# EAGLE design board (EAGLE 9.6.2)
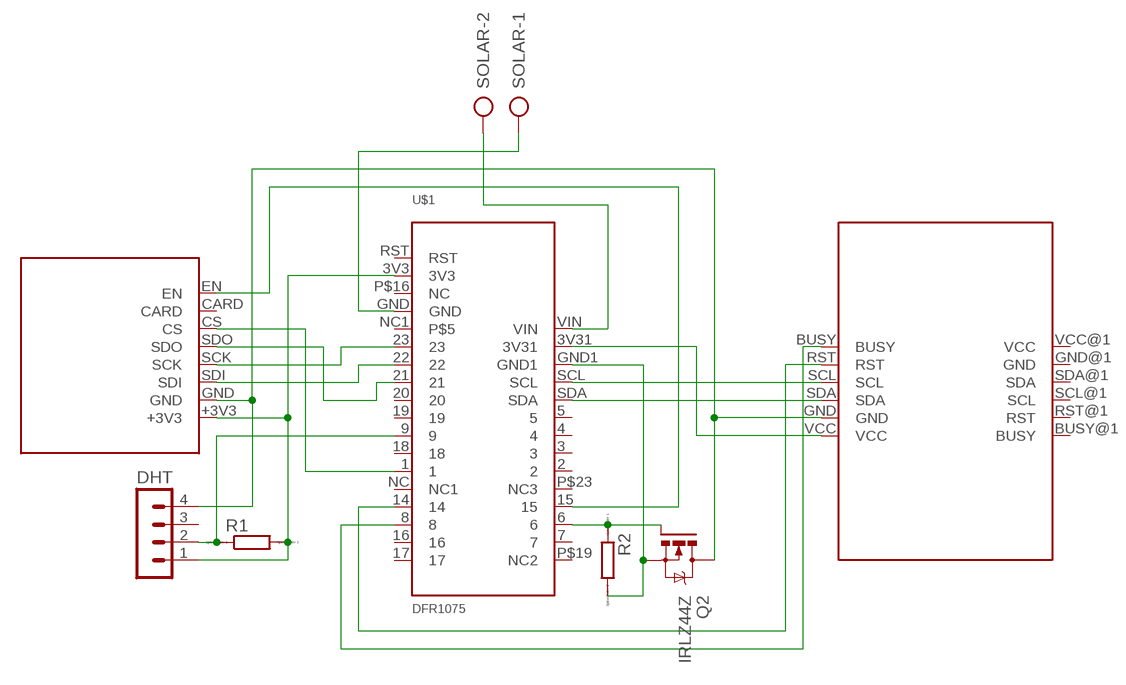
[diagram p0: schematic, sheet 1]

## Parts
DHT  MA04-1  [MA04-1]
Q2  IRLZ44Z  [TO220BH]
R1  R0207/10  [0207/10]
R2  R0207/10  [0207/10]
SOLAR  AK300/2  [AK300/2]
U$1  DFR1075  [DFR1075]
U$2  1.9INCH_WAVESHARE_E-PAPER  [1.9INCH_WAVESHARE_E-PAPER]
U$3  LASKAKIT-MICROSD-READER  [LASKAKIT-MICROSD-READER]

## Nets
BUSY: U$1.8 U$2.BUSY
GND: DHT.4 Q2.D U$2.GND U$3.GND
N$1: Q2.G R2.1 U$1.6
N$2: Q2.S R2.2 U$1.GND1
N$3: U$1.SCL U$2.SCL
N$4: U$1.SDA U$2.SDA
N$5: U$1.3V31 U$2.VCC
N$6: SOLAR.2 U$1.VIN
N$9: DHT.1 R1.2 U$1.3V3 U$3.+3V3
N$10: DHT.2 R1.1 U$1.9
N$11: U$1.22 U$3.SDI
N$12: U$1.23 U$3.SCK
N$13: U$1.21 U$3.SDO
N$14: U$1.1 U$3.CS
N$15: SOLAR.1 U$1.GND
N$16: U$1.15 U$3.EN
RST: U$1.14 U$2.RST
Unconnected: DHT.3 U$1.2 U$1.3 U$1.4 U$1.5 U$1.7 U$1.16 U$1.17 U$1.18 U$1.19 U$1.20 U$1.NC1 U$1.NC(NC1) U$1.P$16(NC) U$1.P$19(NC2) U$1.P$23(NC3) U$1.RST U$2.BUSY@1(BUSY) U$2.GND@1(GND) U$2.RST@1(RST) U$2.SCL@1(SCL) U$2.SDA@1(SDA) U$2.VCC@1(VCC) U$3.CARD

## Library data of the parts
DHT = con-lstb:MA04-1: PIN HEADER; OC_FARNELL: unknown; OC_NEWARK: unknown
Q2 = transistor-power:IRLZ44Z: N-Channel HEXFET® Power MOSFET Logic Level AUTOMOTIVE MOSFET Source: http://www.irf.com/product-info/datasheets/data/irlz44zpbf.pdf
R1 R2 = eagle-ltspice:R: RESISTOR, European symbol; SPICEMODEL: NONE; SPICEPREFIX: R
SOLAR = con-ptr500:AK300/2: CONNECTOR; OC_FARNELL: unknown; OC_NEWARK: unknown
U$1 = Diplomova_prace:DFR1075
U$2 = Diplomova_prace:1.9INCH_WAVESHARE_E-PAPER
U$3 = Diplomova_prace:LASKAKIT-MICROSD-READER

## Board
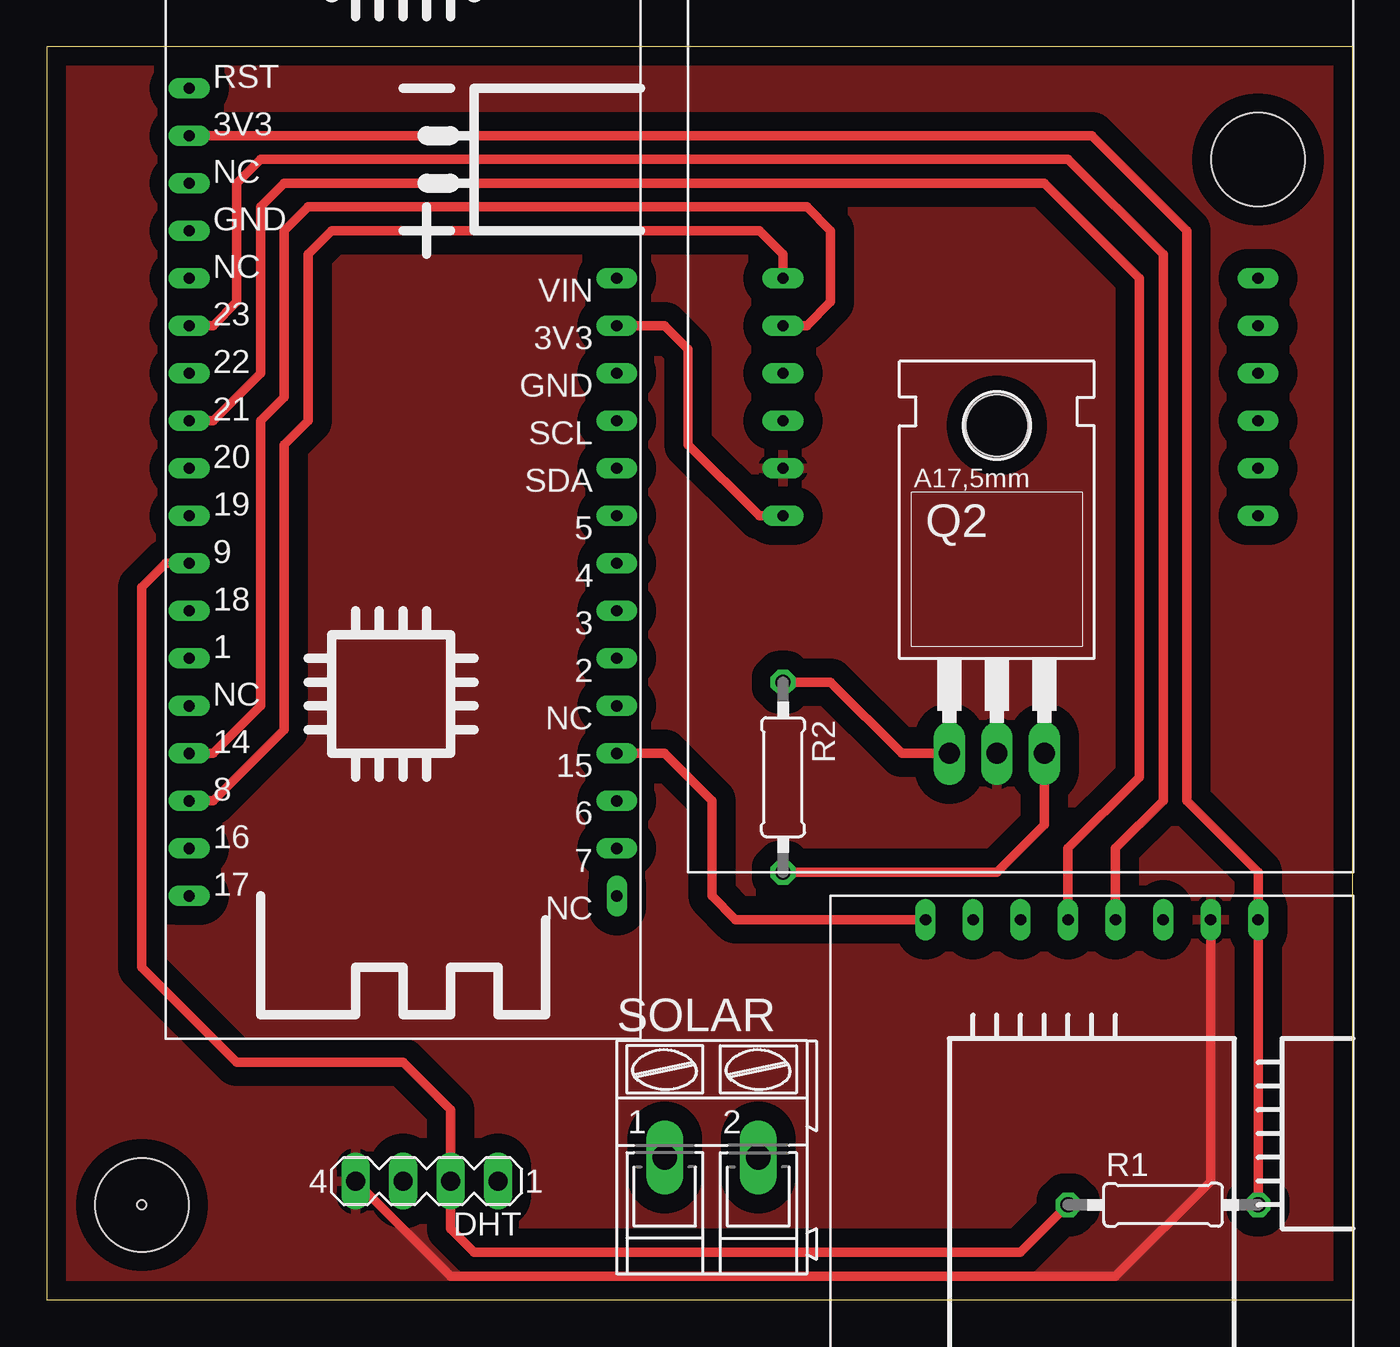
[diagram p1: board, top side]
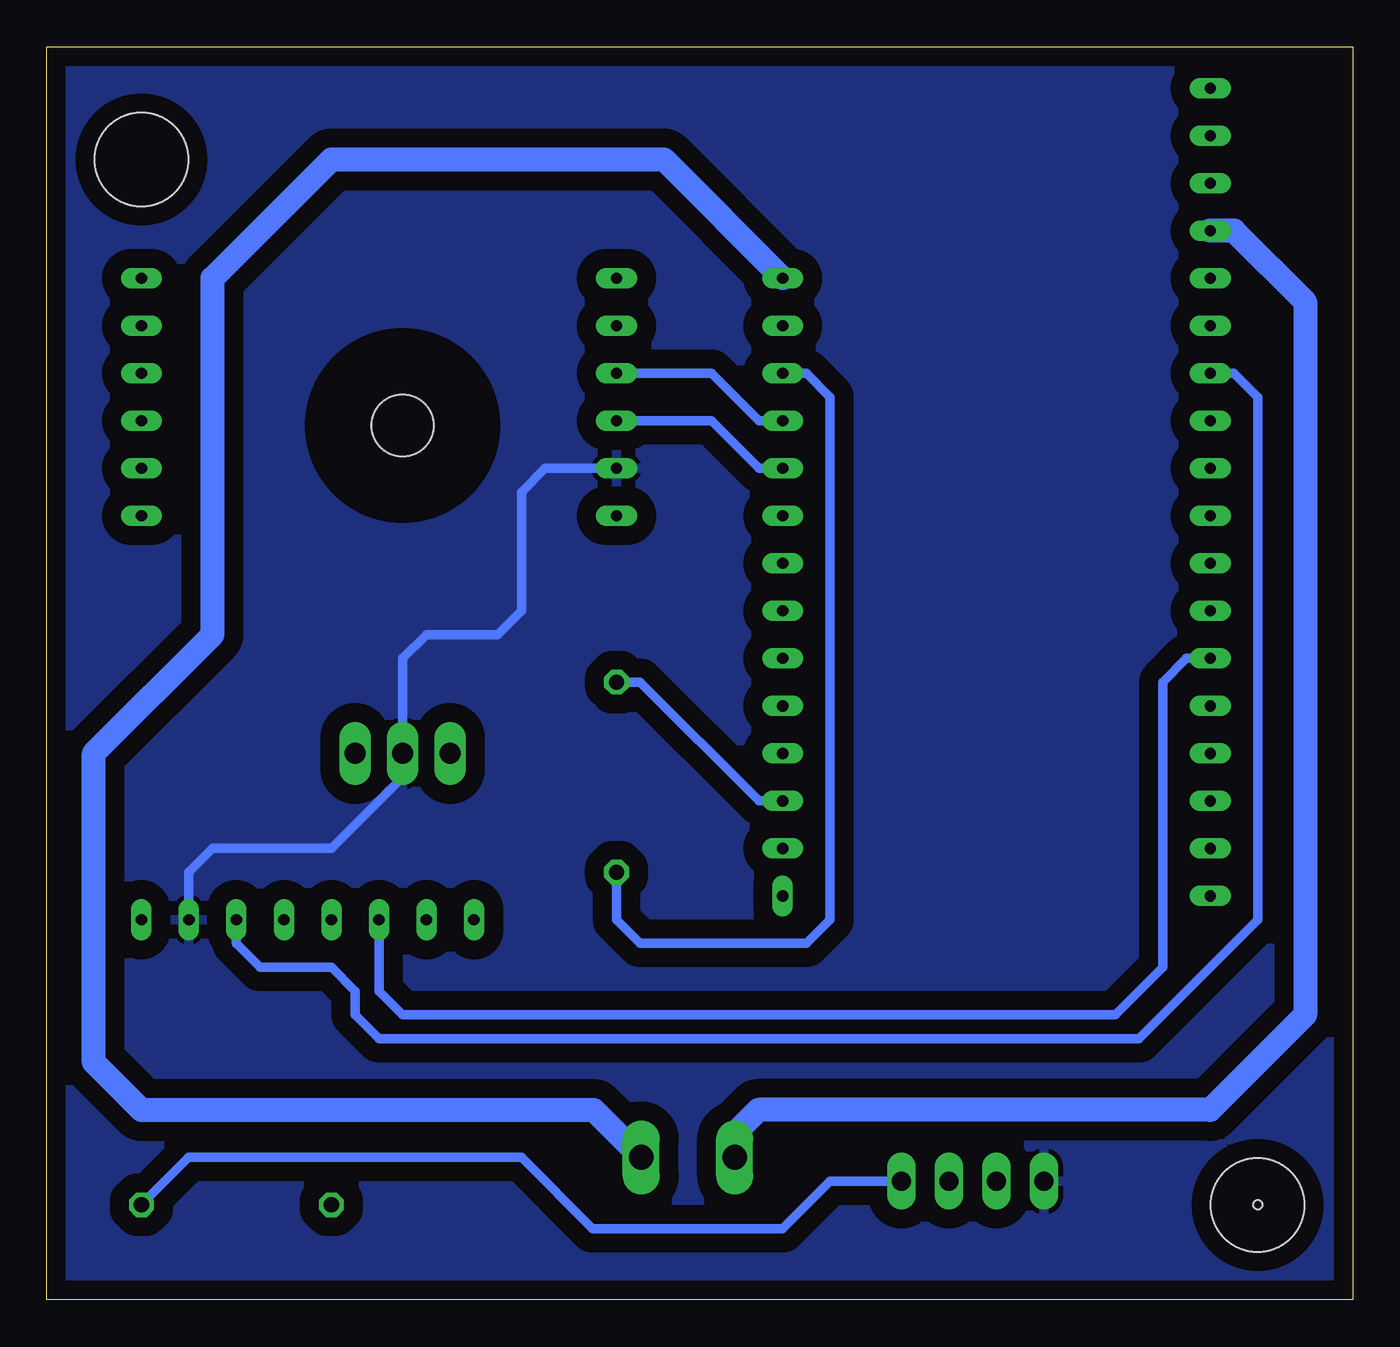
[diagram p2: board, bottom side, seen from below]

Size 69.83 x 66.98 mm. Coordinates in mm from the lower left corner, seen from the top.
Outline: 0,0 69.83,0 69.83,66.98 0,66.98 0,0
Copper layers (1*16): Top 0.035mm / dielectric 1.5mm / Bottom 0.035mm
Design rules "default": minimum track width 6mil, minimum drill 0.35mm, track to track 6mil, track to pad 6mil, pad to pad 6mil, via to via 6mil, smd to smd 6mil, copper to edge 40mil, drill to drill 6mil, minimum pad ring 10mil, minimum via ring 8mil, stop-mask expansion 4mil, vias tented up to drill 0mil, thermal gap 10mil
Holes 0.5 mm at 5.08,5.08
Holes 5 mm at 5.08,5.08 64.77,60.96

### Footprints (pad centres in the part's own frame; a part is rotated, then mirrored left to right if it is on the bottom)
MA04-1 = drill 1.016 long: 1 -3.81,0; 2 -1.27,0; 3 1.27,0; 4 3.81,0
TO220BH = drill 1.118 long: D 0,-6.35; G -2.54,-6.35; S 2.54,-6.35 | hole 3.302: 0,11.176
0207/10 = drill 0.813 octagon: 1 -5.08,0; 2 5.08,0
AK300/2 = drill 1.321 long: 1 -2.515,0; 2 2.489,0
DFR1075 = drill 0.6 long: 1 1.27,20.32; 2 24.13,20.32; 3 24.13,22.86; 3V3 1.27,48.26; 3V31 24.13,38.1; 4 24.13,25.4; 5 24.13,27.94; 6 24.13,12.7; 7 24.13,10.16; 8 1.27,12.7; 9 1.27,25.4; 14 1.27,15.24; 15 24.13,15.24; 16 1.27,10.16; 17 1.27,7.62; 18 1.27,22.86; 19 1.27,27.94; 20 1.27,30.48; 21 1.27,33.02; 22 1.27,35.56; 23 1.27,38.1; GND 1.27,43.18; GND1 24.13,35.56; NC 1.27,17.78; NC1 1.27,40.64; P$16 1.27,45.72; P$19 24.13,7.62; P$23 24.13,17.78; RST 1.27,50.8; SCL 24.13,33.02; SDA 24.13,30.48; VIN 24.13,40.64
1.9INCH_WAVESHARE_E-PAPER = drill 0.6 long: BUSY -12.7,6.35; BUSY@1 12.7,-6.35; GND -12.7,-3.81; GND@1 12.7,3.81; RST -12.7,3.81; RST@1 12.7,-3.81; SCL -12.7,1.27; SCL@1 12.7,-1.27; SDA -12.7,-1.27; SDA@1 12.7,1.27; VCC -12.7,-6.35; VCC@1 12.7,6.35
LASKAKIT-MICROSD-READER = drill 0.6 long: +3V3 -2.54,8.89; CARD -2.54,-6.35; CS -2.54,-3.81; EN -2.54,-8.89; GND -2.54,6.35; SCK -2.54,1.27; SDI -2.54,3.81; SDO -2.54,-1.27

### Placement (x,y rotation side)
DHT  20.32,6.35 180 top
Q2  50.8,35.56 0 top
R1  59.69,5.08 0 top
R2  39.37,27.94 270 top
SOLAR  35.56,7.62 0 top
U$1  6.35,13.97 0 top
U$2  52.07,48.26 0 top
U$3  55.88,17.78 270 top

### Tracks (layer width: path | path; a pad name or v marks a point on that pad's centre or on a via)
BUSY
  Top 0.508: U$1.8 8.89,26.67 12.7,30.48 12.7,45.72 13.97,46.99 13.97,55.88 15.24,57.15 38.1,57.15 39.37,55.88 U$2.BUSY
GND
  Top 0.508: DHT.4 21.59,1.27 57.15,1.27 62.23,6.35 U$3.GND
  Bottom 0.508: U$3.GND 62.23,22.86 60.96,24.13 54.61,24.13 50.8,27.94 Q2.D 50.8,34.29 49.53,35.56 45.72,35.56 44.45,36.83 44.45,43.18 43.18,44.45 U$2.GND
  pour Bottom (isolate 1.016): -5.08,74.93 78.74,74.93 78.74,-6.35 -5.08,-6.35
  pour Top (isolate 1.016): -6.35,74.93 76.2,74.93 76.2,-3.81 -6.35,-3.81
N$1
  Top 0.508: Q2.G 45.72,29.21 41.91,33.02 R2.1
  Bottom 0.508: U$1.6 31.75,26.67 38.1,33.02 R2.1
N$2
  Top 0.508: R2.2 50.8,22.86 53.34,25.4 Q2.S
  Bottom 0.508: U$1.GND1 29.21,49.53 27.94,48.26 27.94,20.32 29.21,19.05 38.1,19.05 39.37,20.32 R2.2 | Q2.S 53.34,28.45
N$3
  Bottom 0.508: U$1.SCL 31.75,46.99 34.29,49.53 U$2.SCL
N$4
  Bottom 0.508: U$1.SDA 31.75,44.45 34.29,46.99 U$2.SDA
N$5
  Top 0.508: U$1.3V31 33.02,52.07 34.29,50.8 34.29,45.72 38.1,41.91 U$2.VCC
N$6
  Bottom 1.27: U$1.VIN 36.83,60.96 54.61,60.96 60.96,54.61 60.96,35.56 67.31,29.21 67.31,12.7 64.77,10.16 40.59,10.16 SOLAR.2
N$9
  Top 0.508: U$1.3V3 55.88,62.23 60.96,57.15 60.96,26.67 64.77,22.86 U$3.+3V3 R1.2
  Bottom 0.508: DHT.1 27.94,6.35 30.48,3.81 40.64,3.81 44.45,7.62 62.23,7.62 R1.2
N$10
  Top 0.508: U$1.9 6.35,39.37 5.08,38.1 5.08,17.78 10.16,12.7 19.05,12.7 21.59,10.16 DHT.2 21.59,3.81 22.86,2.54 52.07,2.54 R1.1
N$11
  Bottom 0.508: U$3.SDI 59.69,19.05 58.42,17.78 54.61,17.78 53.34,16.51 53.34,15.24 52.07,13.97 11.43,13.97 5.08,20.32 5.08,48.26 6.35,49.53 U$1.22
N$12
  Top 0.508: U$3.SCK 57.15,24.13 59.69,26.67 59.69,55.88 54.61,60.96 11.43,60.96 10.16,59.69 10.16,53.34 8.89,52.07 U$1.23
N$13
  Top 0.508: U$3.SDO 54.61,24.13 58.42,27.94 58.42,54.61 53.34,59.69 12.7,59.69 11.43,58.42 11.43,49.53 8.89,46.99 U$1.21
N$14
  Bottom 0.508: U$1.1 8.89,34.29 10.16,33.02 10.16,17.78 12.7,15.24 50.8,15.24 52.07,16.51 U$3.CS
N$15
  Bottom 1.27: U$1.GND 6.35,57.15 2.54,53.34 2.54,15.24 7.62,10.16 31.77,10.16 33.05,8.89 SOLAR.1
N$16
  Top 0.508: U$1.15 33.02,29.21 35.56,26.67 35.56,21.59 36.83,20.32 U$3.EN
RST
  Top 0.508: U$1.14 8.89,29.21 11.43,31.75 11.43,46.99 12.7,48.26 12.7,57.15 13.97,58.42 40.64,58.42 41.91,57.15 41.91,53.34 40.64,52.07 U$2.RST